# EAGLE schematic aday_2 (EAGLE 9.6.2)
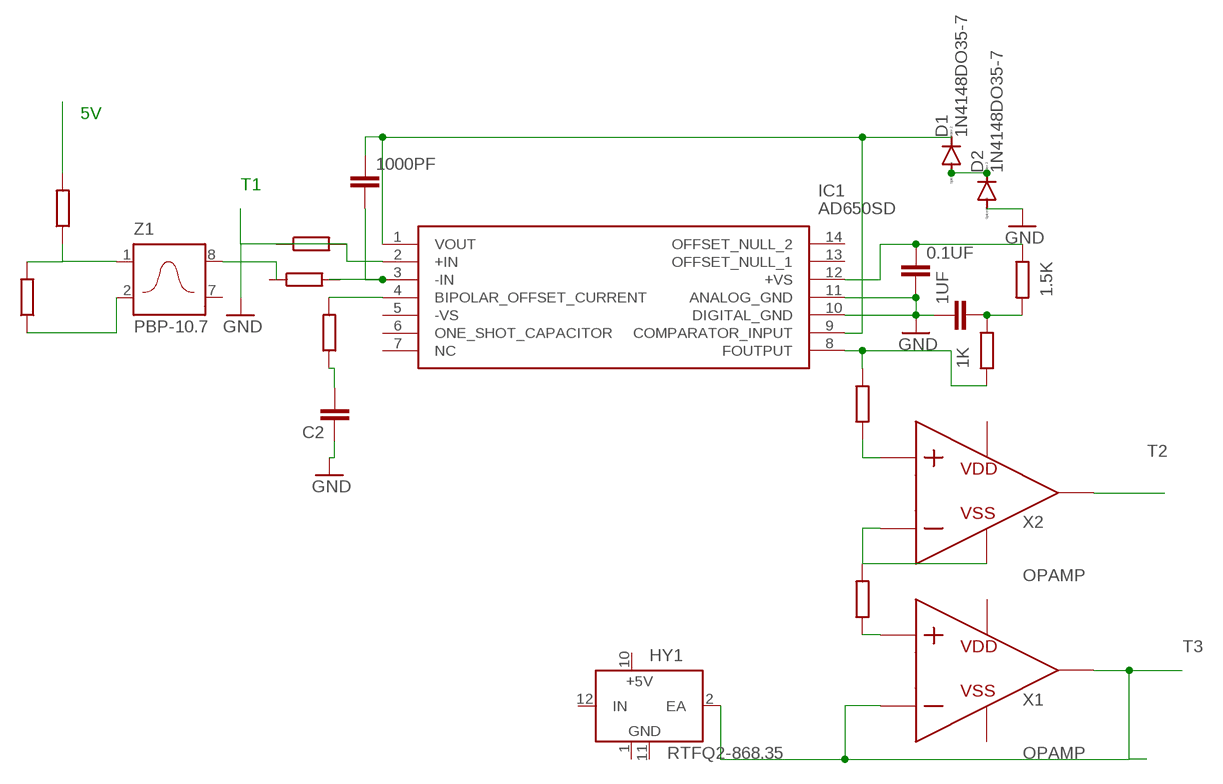
[diagram p0: schematic, sheet 1]

## Parts
0.1UF  C2.5/2  [C2.5-2]
1.5K  R  (no package)
1K  R  (no package)
1UF  C2.5/2  [C2.5-2]
1000PF  C2.5/2  [C2.5-2]
C2  C2.5/2  [C2.5-2]
D1  1N4148DO35-7  [DO35-7]
D2  1N4148DO35-7  [DO35-7]
HY1  RTFQ2-868.35  [RTFQ2]
IC1  AD650SD  [DIP775W58P254L1943H508Q14N]
X1  OPAMP  (no package)
X2  OPAMP  (no package)
Z1  PBP-10.7  [A01]

## Nets
GND: 0.1UF.2 1UF.1 C2.1 D2.A IC1.2(+IN) IC1.10(DIGITAL_GND) IC1.11(ANALOG_GND)
N$1: D1.A D2.C
N$2: 0.1UF.1 1.5K.1 IC1.12(+VS)
N$3: 1K.1 IC1.8(FOUTPUT)
N$4: 1000PF.1 D1.C IC1.1(VOUT) IC1.9(COMPARATOR_INPUT)
N$5: X2.P
N$6: 1.5K.2 1K.2 1UF.2
N$7: X2.N X2.VSS
N$8: X1.P
N$9: 1000PF.2 IC1.3(-IN)
N$10: Z1.8(OUT)
N$11: IC1.4(BIPOLAR_OFFSET_CURRENT)
N$12: C2.2
N$13: Z1.1(IN)
N$15: Z1.2(GND)
T2: X2.VOUT
T3: HY1.2(EA) X1.N X1.VOUT
Unconnected: HY1.12(IN) IC1.5(-VS) IC1.6(ONE_SHOT_CAPACITOR) IC1.7(NC) IC1.13(OFFSET_NULL_1) IC1.14(OFFSET_NULL_2) X1.VDD X1.VSS X2.VDD Z1.7(GND)

## Notes on the sheet
- 5V
- T1

## Power pins joined to a net without a drawn wire
+5V: HY1.10(+5V)
GND: HY1.1(GND) HY1.11(GND) Z1.3(GND) Z1.4(GND) Z1.5(GND) Z1.6(GND)

## Library data of the parts
0.1UF 1UF 1000PF C2 = capacitor-wima:C: CAPACITOR naming: grid - package width
1.5K 1K = ngspice-simulation:R: RESISTOR
D1 D2 = diode:1N4148: DIODE high speed (Philips)
HY1 = telecontrolli:RTFQ2-*: FSK Radio Transmitter with Crystal Oscillator and External Antenna Source: http://www.telecontrolli.com/eng/default-wproducts.html ... rtfq2.pdf; OC_FARNELL: unknown; OC_NEWARK: unknown
IC1 = AD650SD:AD650SD: ANALOG DEVICES - AD650SD - V/F/V CONVERTER, 1MHZ, DIP-14 Source: Datasheet <https://www.analog.com/media/en/technical-documentation/data-sheets/AD650.pdf>; ARROW_PART_NUMBER: AD650SD; ARROW_PRICE-STOCK: https://www.arrow.com/en/products/ad650sd/analog-devices; DESCRIPTION: ANALOG DEVICES - AD650SD - V/F/V CONVERTER, 1MHZ, DIP-14; HEIGHT: 5.08mm; MANUFACTURER_NAME: Analog Devices; MANUFACTURER_PART_NUMBER: AD650SD; MOUSER_PART_NUMBER: 584-AD650SD; MOUSER_PRICE-STOCK: https://www.mouser.co.uk/ProductDetail/Analog-Devices/AD650SD?qs=NmRFExCfTkGUYsKvHm%2FjFQ%3D%3D
X1 X2 = ngspice-simulation:OPAMP: Operational amplifier with power pins
Z1 = minicircuits:PBP-10.7: Band Pass Filter Source: minicircuits.com .. PBP-10.7+.pdf; OC_FARNELL: unknown; OC_NEWARK: unknown